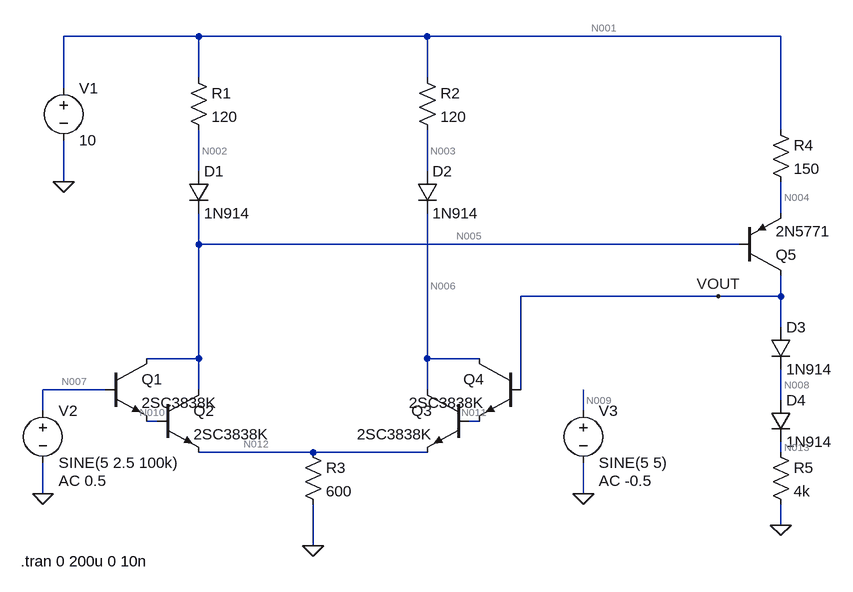
[diagram p0: schematic buffer002.asc]
buffer002.asc, the LTspice schematic file:
Version 4
SHEET 1 1444 840
WIRE 320 16 112 16
WIRE 672 16 320 16
WIRE 1216 16 672 16
WIRE 320 80 320 16
WIRE 672 80 672 16
WIRE 112 96 112 16
WIRE 1216 160 1216 16
WIRE 320 224 320 160
WIRE 672 224 672 160
WIRE 112 240 112 176
WIRE 1216 288 1216 240
WIRE 320 336 320 288
WIRE 1152 336 320 336
WIRE 1120 416 816 416
WIRE 1216 416 1216 384
WIRE 1216 416 1120 416
WIRE 1216 464 1216 416
WIRE 320 512 320 336
WIRE 320 512 240 512
WIRE 672 512 672 288
WIRE 752 512 672 512
WIRE 176 560 80 560
WIRE 320 560 320 512
WIRE 672 560 672 512
WIRE 816 560 816 416
WIRE 1216 576 1216 528
WIRE 80 592 80 560
WIRE 912 592 912 560
WIRE 256 608 240 608
WIRE 752 608 736 608
WIRE 496 656 320 656
WIRE 672 656 496 656
WIRE 1216 656 1216 640
WIRE 80 720 80 672
WIRE 912 720 912 672
WIRE 1216 768 1216 736
WIRE 496 800 496 736
FLAG 112 240 0
FLAG 496 800 0
FLAG 80 720 0
FLAG 912 720 0
FLAG 1216 768 0
FLAG 1120 416 VOUT
SYMBOL voltage 112 80 R0
WINDOW 123 0 0 Left 0
WINDOW 39 0 0 Left 0
SYMATTR InstName V1
SYMATTR Value 10
SYMBOL res 304 64 R0
SYMATTR InstName R1
SYMATTR Value 120
SYMBOL diode 304 224 R0
SYMATTR InstName D1
SYMATTR Value 1N914
SYMBOL npn 176 512 R0
SYMATTR InstName Q1
SYMATTR Value 2SC3838K
SYMBOL res 656 64 R0
SYMATTR InstName R2
SYMATTR Value 120
SYMBOL diode 656 224 R0
SYMATTR InstName D2
SYMATTR Value 1N914
SYMBOL npn 256 560 R0
SYMATTR InstName Q2
SYMATTR Value 2SC3838K
SYMBOL npn 736 560 M0
SYMATTR InstName Q3
SYMATTR Value 2SC3838K
SYMBOL npn 816 512 M0
SYMATTR InstName Q4
SYMATTR Value 2SC3838K
SYMBOL res 480 640 R0
SYMATTR InstName R3
SYMATTR Value 600
SYMBOL voltage 80 576 R0
WINDOW 123 24 124 Left 2
WINDOW 39 0 0 Left 0
SYMATTR InstName V2
SYMATTR Value SINE(5 2.5 100k)
SYMATTR Value2 AC 0.5
SYMBOL voltage 912 576 R0
WINDOW 123 24 124 Left 2
WINDOW 39 0 0 Left 0
SYMATTR InstName V3
SYMATTR Value SINE(5 5)
SYMATTR Value2 AC -0.5
SYMBOL pnp 1152 384 M180
SYMATTR InstName Q5
SYMATTR Value 2N5771
SYMBOL res 1200 144 R0
SYMATTR InstName R4
SYMATTR Value 150
SYMBOL diode 1200 464 R0
SYMATTR InstName D3
SYMATTR Value 1N914
SYMBOL diode 1200 576 R0
SYMATTR InstName D4
SYMATTR Value 1N914
SYMBOL res 1200 640 R0
SYMATTR InstName R5
SYMATTR Value 4k
TEXT 46 824 Left 2 !.tran 0 200u 0 10n

The netlist it stands for:
* buffer002.asc
V1 N001 0 10
R1 N001 N002 120
D1 N002 N005 1N914
Q1 N005 N007 N010 0 2SC3838K
R2 N001 N003 120
D2 N003 N006 1N914
Q2 N005 N010 N012 0 2SC3838K
Q3 N006 N011 N012 0 2SC3838K
Q4 N006 VOUT N011 0 2SC3838K
R3 N012 0 600
V2 N007 0 SINE(5 2.5 100k) AC 0.5
V3 N009 0 SINE(5 5) AC -0.5
Q5 VOUT N005 N004 0 2N5771
R4 N001 N004 150
D3 VOUT N008 1N914
D4 N008 N013 1N914
R5 N013 0 4k
.model D D
.lib standard.dio
.model NPN NPN
.model PNP PNP
.lib standard.bjt
.tran 0 200u 0 10n
.backanno
.end

* Results of the author's LTspice run, read from the files saved beside the schematic
* Operating Point, zero values left out:
*   V(n001) = 10 V
*   V(n002) = 9.744 V
*   V(n005) = 9.124 V
*   V(n007) = 5 V
*   V(n010) = 4.385 V
*   V(n003) = 9.528 V
*   V(n006) = 8.879 V
*   V(n012) = 3.651 V
*   V(n011) = 4.401 V
*   V(vout) = 5.033 V
*   V(n009) = 5 V
*   V(n004) = 9.853 V
*   V(n008) = 4.449 V
*   V(n013) = 3.866 V
*   Ic(Q5) = -967 µA
*   Ib(Q5) = -12.33 µA
*   Ie(Q5) = 979.3 µA
*   Ic(Q4) = 41.5 µA
*   Ib(Q4) = 440.3 nA
*   Ie(Q4) = -41.94 µA
*   Ic(Q3) = 3.895 mA
*   Ib(Q3) = 41.94 µA
*   Ie(Q3) = -3.937 mA
*   Ic(Q2) = 2.125 mA
*   Ib(Q2) = 22.44 µA
*   Ie(Q2) = -2.147 mA
*   Ic(Q1) = 22.2 µA
*   Ib(Q1) = 237.1 nA
*   Ie(Q1) = -22.45 µA
*   I(D4) = 966.6 µA
*   I(D3) = 966.6 µA
*   I(D2) = 3.937 mA
*   I(D1) = 2.135 mA
*   I(R5) = 966.6 µA
*   I(R4) = 979.3 µA
*   I(R3) = 6.084 mA
*   I(R2) = 3.937 mA
*   I(R1) = 2.135 mA
*   I(V2) = -237.1 nA
*   I(V1) = -7.051 mA
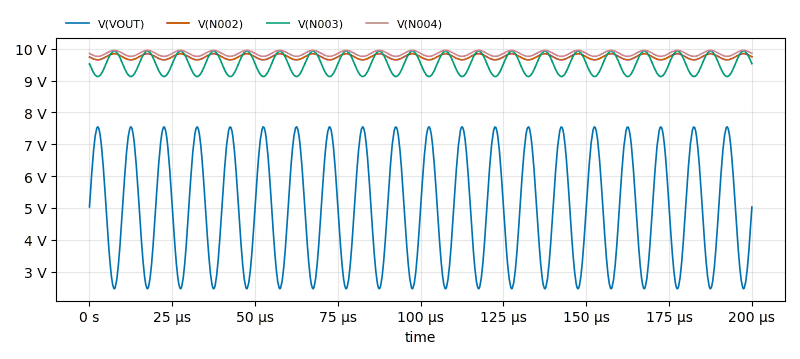
[diagram p1: Transient Analysis of buffer002.asc, plotted from the saved traces]
* Transient Analysis, 1 run:
*   V(VOUT): min 2.463 V, max 7.55 V, average 5.021 V, rms 5.333 V, last 5.032 V
*   V(N002): min 9.65 V, max 9.843 V, average 9.745 V, rms 9.745 V, last 9.743 V
*   V(N003): min 9.126 V, max 9.922 V, average 9.526 V, rms 9.53 V, last 9.53 V
*   V(N004): min 9.759 V, max 9.947 V, average 9.853 V, rms 9.853 V, last 9.852 V